# EasyEDA schematic large display.json
TITLE: Sheet_1; REV: 1.0; Date: 2021-09-05; Sheet: 1/1; Drawn By: usman.ashraf678; Company: Your Company
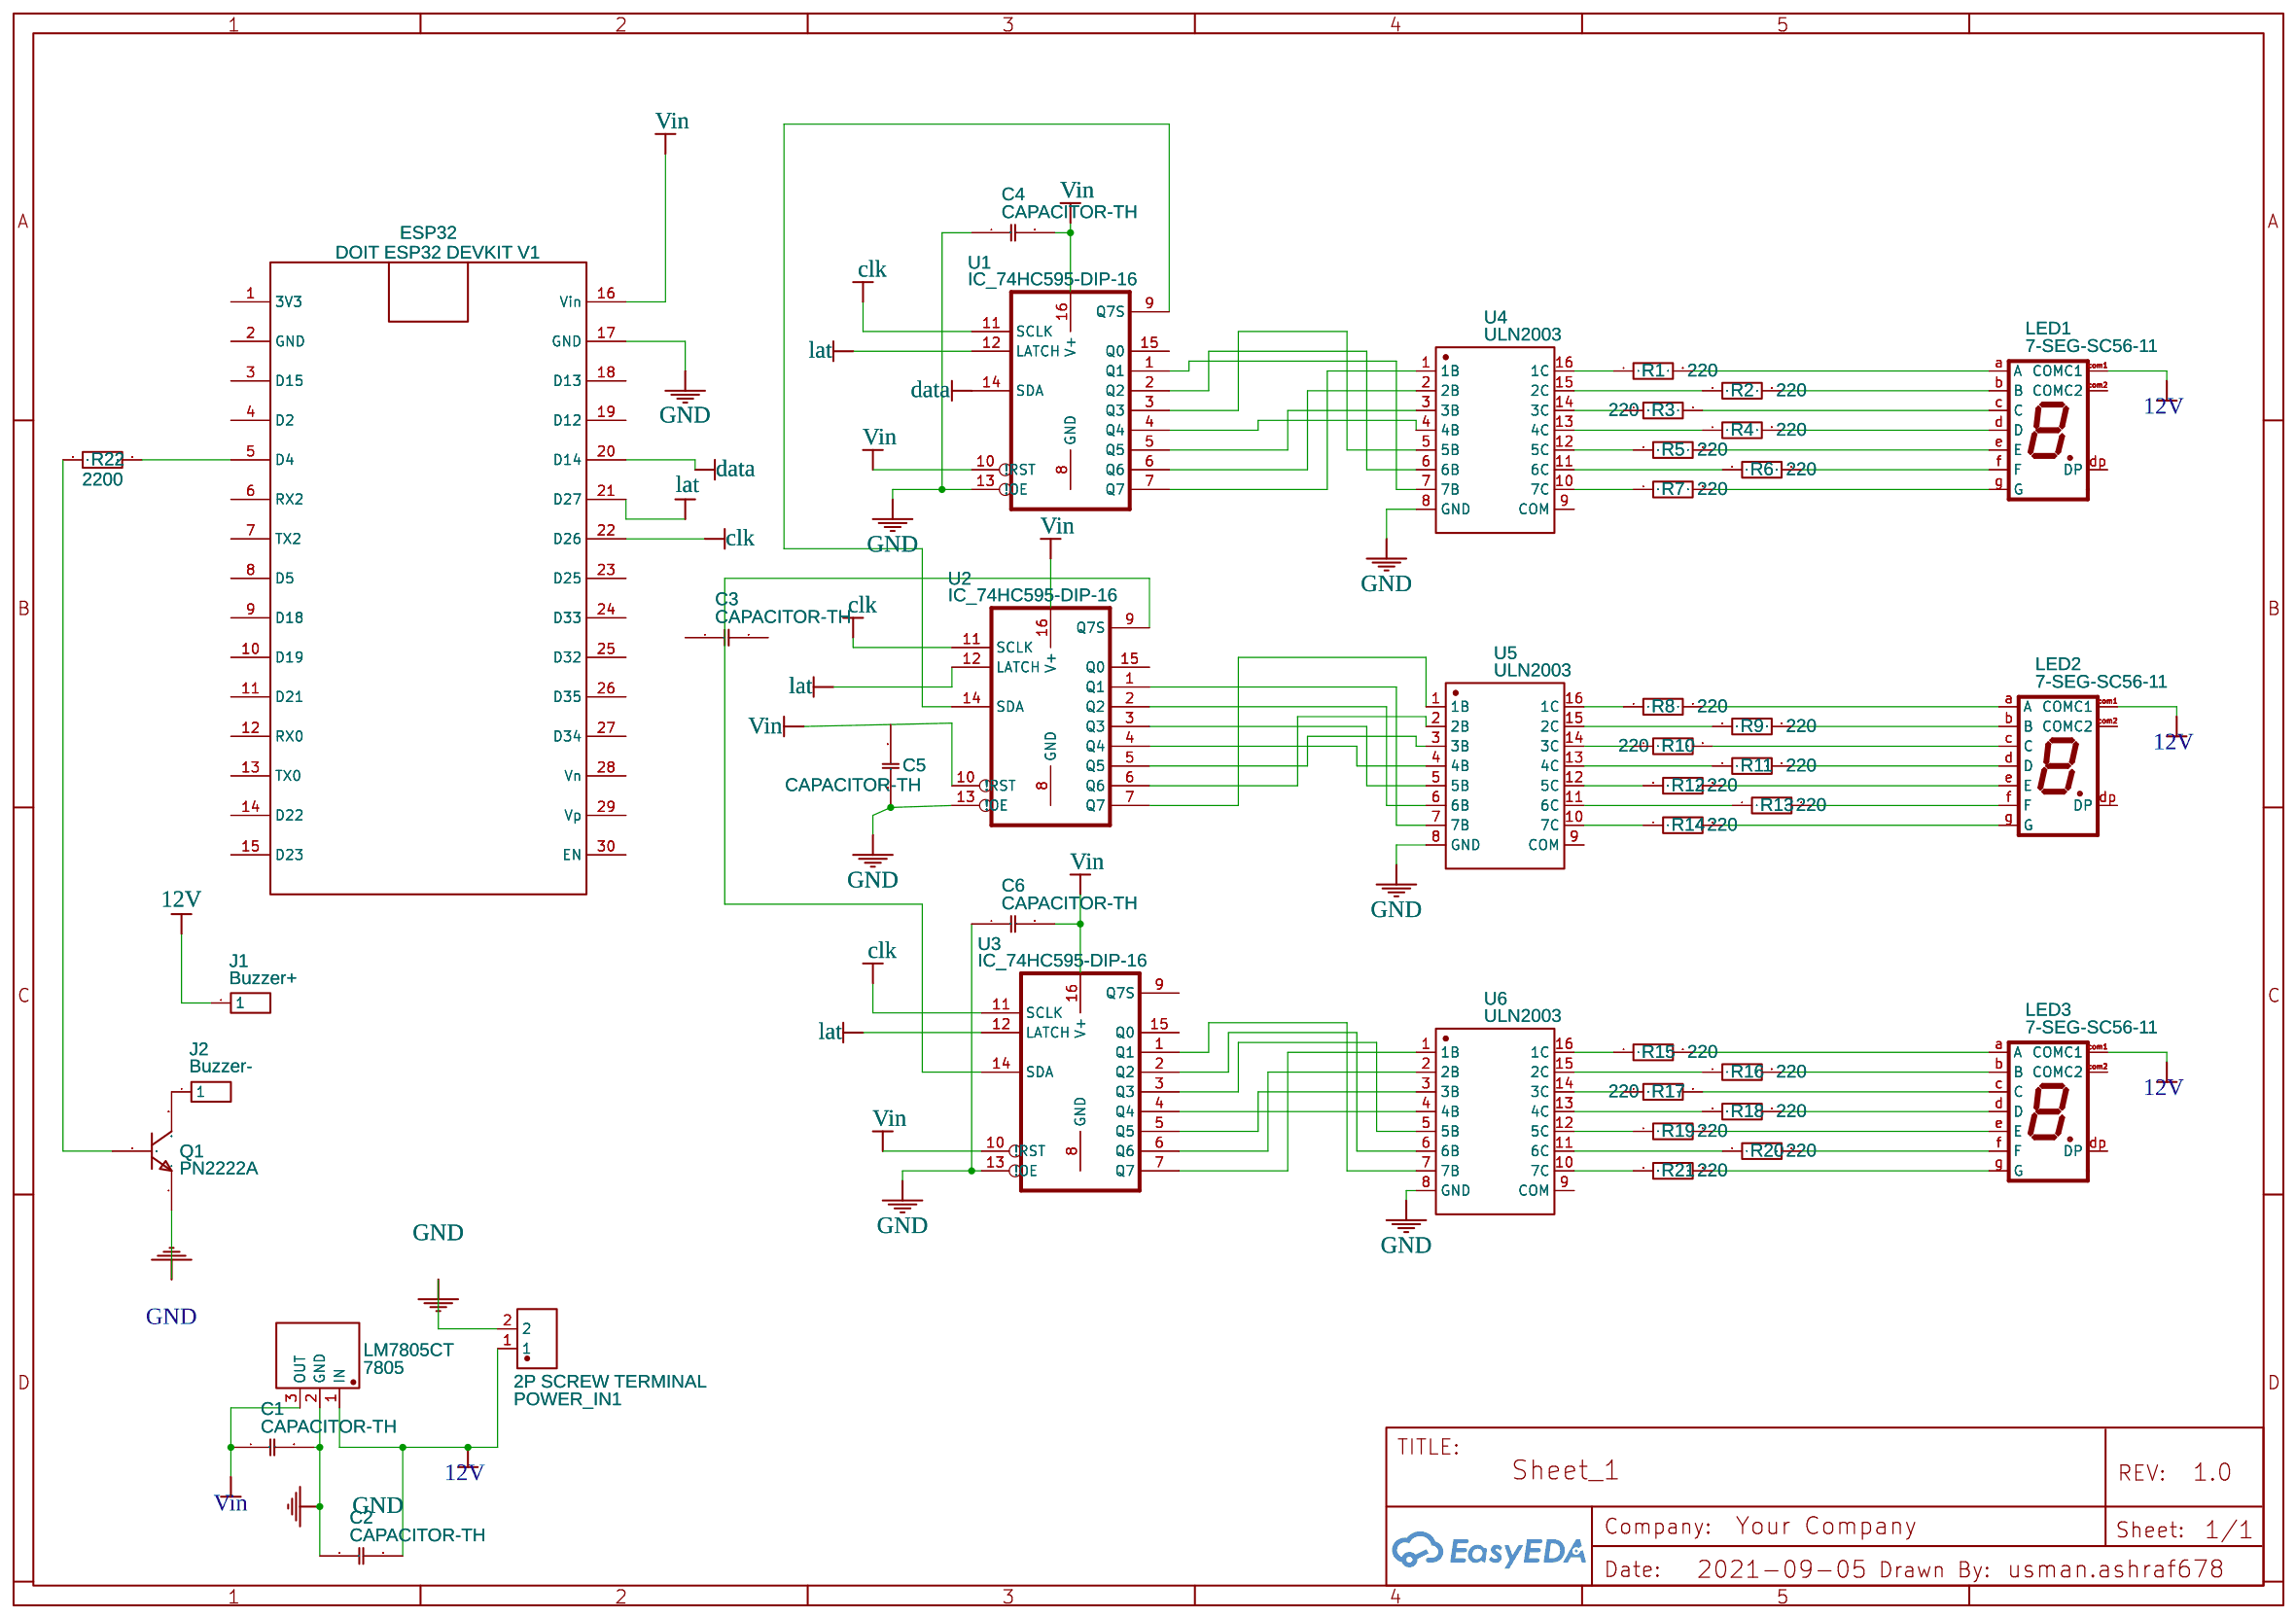
[diagram p0: schematic sheet]

## Parts
7805  LM7805CT  [TO-220-3_L10.0-W4.5-P2.54-L]
C1  CAPACITOR-TH  [CAPACITOR-TH]
C2  CAPACITOR-TH  [CAPACITOR-TH]
C3  CAPACITOR-TH  [CAPACITOR-TH]
C4  CAPACITOR-TH  [CAPACITOR-TH]
C5  CAPACITOR-TH  [CAPACITOR-TH]
C6  CAPACITOR-TH  [CAPACITOR-TH]
ESP32  DOIT ESP32 DEVKIT V1  [DOIT_ESP32]
J1  Buzzer+  [HDR-M-2.54_1X1]
J2  Buzzer-  [HDR-M-2.54_1X1]
LED1  7-SEG-SC56-11  [4 INCH SEVEN SEGMENT DISPLAY]
LED2  7-SEG-SC56-11  [4 INCH SEVEN SEGMENT DISPLAY]
LED3  7-SEG-SC56-11  [4 INCH SEVEN SEGMENT DISPLAY]
POWER_IN1  2P SCREW TERMINAL  [2P SCREW TERMINAL]
Q1  PN2222A  [TO220]
R1  220  [RES TH LONG WIRE]
R2  220  [RES TH LONG WIRE]
R3  220  [RES TH LONG WIRE]
R4  220  [RES TH LONG WIRE]
R5  220  [RES TH LONG WIRE]
R6  220  [RES TH LONG WIRE]
R7  220  [RES TH LONG WIRE]
R8  220  [RES TH LONG WIRE]
R9  220  [RES TH LONG WIRE]
R10  220  [RES TH LONG WIRE]
R11  220  [RES TH LONG WIRE]
R12  220  [RES TH LONG WIRE]
R13  220  [RES TH LONG WIRE]
R14  220  [RES TH LONG WIRE]
R15  220  [RES TH LONG WIRE]
R16  220  [RES TH LONG WIRE]
R17  220  [RES TH LONG WIRE]
R18  220  [RES TH LONG WIRE]
R19  220  [RES TH LONG WIRE]
R20  220  [RES TH LONG WIRE]
R21  220  [RES TH LONG WIRE]
R22  2200  [RES TH LONG WIRE]
U1  IC_74HC595-DIP-16  [DIP16 THICK PADS]
U2  IC_74HC595-DIP-16  [DIP16 THICK PADS]
U3  IC_74HC595-DIP-16  [DIP16 THICK PADS]
U4  ULN2003  [DIP16 THICK PADS]
U5  ULN2003  [DIP16 THICK PADS]
U6  ULN2003  [DIP16 THICK PADS]

## Library data of the parts
7805 = LM7805CT: Supplier: LCSC; Manufacturer: FAIRCHILD; Supplier Part: C22146
C1-C6 = CAPACITOR-TH: Contributor: hctan22
ESP32 = DOIT ESP32 DEVKIT V1: Contributor: ณัฏฐพล พงศ์ไพบูลย์วิริยะ
J1 J2 = HDR-M-2.54_1x1: Supplier Part: C81276; Supplier: LCSC; Contributor: LCEDA_Lib
LED1-LED3 = 7-SEG-SC56-11: sourceId: Xg4EQOoXx; link: http://www.farnell.com/datasheets/1864138.pdf
POWER_IN1 = 2P SCREW TERMINAL: Contributor: teptical1
Q1 = PN2222A: NPN General Purpose Amplifier
R1-R22 = MF1/8W ±1% 220Ω STB5: Supplier: LCSC; Supplier Part: C337135; Manufacturer: FlyWin; Contributor: LCSC; JLCPCB Part Class: Extended Part
U1-U3 = IC_74HC595-DIP-16: 8-bit serial-in parallel out shift register, output latch 3-state; Contributor: DangerousPrototype
U4-U6 = ULN2003: Contributor: ToureSekou

## Nets
12V: 7805.1(IN) C2.2 J1.1 LED1.com1(COMC1) LED2.com1(COMC1) LED3.com1(COMC1) POWER_IN1.1
GND: 7805.2(GND) C1.2 C2.1 C4.1 C5.1 C6.1 ESP32.17(GND) POWER_IN1.2 Q1.1(E) U1.13(!OE) U2.13(!OE) U3.13(!OE) U4.8(GND) U5.8(GND) U6.8(GND)
Vin: 7805.3(OUT) C1.1 C4.2 C6.2 ESP32.16(Vin) U1.10(!RST) U1.16(V+) U2.10(!RST) U2.16(V+) U3.10(!RST) U3.16(V+)
clk: ESP32.22(D26) U1.11(SCLK) U2.11(SCLK) U3.11(SCLK)
data: ESP32.20(D14) U1.14(SDA)
lat: ESP32.21(D27) U1.12(LATCH) U2.12(LATCH) U3.12(LATCH)
Net-(ESP32-5): ESP32.5(D4) R22.2
Net-(J2-1): J2.1 Q1.3(C)
Net-(LED1-a): LED1.a(A) R1.2
Net-(LED1-b): LED1.b(B) R2.2
Net-(LED1-c): LED1.c(C) R3.2
Net-(LED1-d): LED1.d(D) R4.2
Net-(LED1-e): LED1.e(E) R5.2
Net-(LED1-f): LED1.f(F) R6.2
Net-(LED1-g): LED1.g(G) R7.2
Net-(LED2-a): LED2.a(A) R8.2
Net-(LED2-b): LED2.b(B) R9.2
Net-(LED2-c): LED2.c(C) R10.2
Net-(LED2-d): LED2.d(D) R11.2
Net-(LED2-e): LED2.e(E) R12.2
Net-(LED2-f): LED2.f(F) R13.2
Net-(LED2-g): LED2.g(G) R14.2
Net-(LED3-a): LED3.a(A) R15.2
Net-(LED3-b): LED3.b(B) R16.2
Net-(LED3-c): LED3.c(C) R17.2
Net-(LED3-d): LED3.d(D) R18.2
Net-(LED3-e): LED3.e(E) R19.2
Net-(LED3-f): LED3.f(F) R20.2
Net-(LED3-g): LED3.g(G) R21.2
Net-(Q1-2): Q1.2(B) R22.1
Net-(R1-1): R1.1 U4.16(1C)
Net-(R2-1): R2.1 U4.15(2C)
Net-(R3-1): R3.1 U4.14(3C)
Net-(R4-1): R4.1 U4.13(4C)
Net-(R5-1): R5.1 U4.12(5C)
Net-(R6-1): R6.1 U4.11(6C)
Net-(R7-1): R7.1 U4.10(7C)
Net-(R8-1): R8.1 U5.16(1C)
Net-(R9-1): R9.1 U5.15(2C)
Net-(R10-1): R10.1 U5.14(3C)
Net-(R11-1): R11.1 U5.13(4C)
Net-(R12-1): R12.1 U5.12(5C)
Net-(R13-1): R13.1 U5.11(6C)
Net-(R14-1): R14.1 U5.10(7C)
Net-(R15-1): R15.1 U6.16(1C)
Net-(R16-1): R16.1 U6.15(2C)
Net-(R17-1): R17.1 U6.14(3C)
Net-(R18-1): R18.1 U6.13(4C)
Net-(R19-1): R19.1 U6.12(5C)
Net-(R20-1): R20.1 U6.11(6C)
Net-(R21-1): R21.1 U6.10(7C)
Net-(U1-1): U1.1(Q1) U4.7(7B)
Net-(U1-2): U1.2(Q2) U4.6(6B)
Net-(U1-3): U1.3(Q3) U4.5(5B)
Net-(U1-4): U1.4(Q4) U4.4(4B)
Net-(U1-5): U1.5(Q5) U4.3(3B)
Net-(U1-6): U1.6(Q6) U4.2(2B)
Net-(U1-7): U1.7(Q7) U4.1(1B)
Net-(U1-9): U1.9(Q7S) U2.14(SDA)
Net-(U2-1): U2.1(Q1) U5.7(7B)
Net-(U2-2): U2.2(Q2) U5.6(6B)
Net-(U2-3): U2.3(Q3) U5.5(5B)
Net-(U2-4): U2.4(Q4) U5.4(4B)
Net-(U2-5): U2.5(Q5) U5.3(3B)
Net-(U2-6): U2.6(Q6) U5.2(2B)
Net-(U2-7): U2.7(Q7) U5.1(1B)
Net-(U2-9): U2.9(Q7S) U3.14(SDA)
Net-(U3-1): U3.1(Q1) U6.7(7B)
Net-(U3-2): U3.2(Q2) U6.6(6B)
Net-(U3-3): U3.3(Q3) U6.5(5B)
Net-(U3-4): U3.4(Q4) U6.4(4B)
Net-(U3-5): U3.5(Q5) U6.3(3B)
Net-(U3-6): U3.6(Q6) U6.2(2B)
Net-(U3-7): U3.7(Q7) U6.1(1B)

Not connected (* = marked no-connect by the designer): C3 1 2; C5 2; ESP32 1(3V3) 2(GND) 3(D15) 4(D2) 6(RX2) 7(TX2) 8(D5) 9(D18) 10(D19) 11(D21) 12(RX0) 13(TX0) 14(D22) 15(D23) 18(D13) 19(D12) 23(D25) 24(D33) 25(D32) 26(D35) 27(D34) 28(Vn) 29(Vp) 30(EN); LED1 com2(COMC2) dp(DP); LED2 com2(COMC2) dp(DP); LED3 com2(COMC2) dp(DP); U1 8(GND) 15(Q0); U2 8(GND) 15(Q0); U3 8(GND) 9(Q7S) 15(Q0); U4 9(COM); U5 9(COM); U6 9(COM)
